# Altium schematic sheet POWER.SchDoc: Fogget
size A4; Revision: 0.1; SheetNumber: 3; SheetTotal: 7
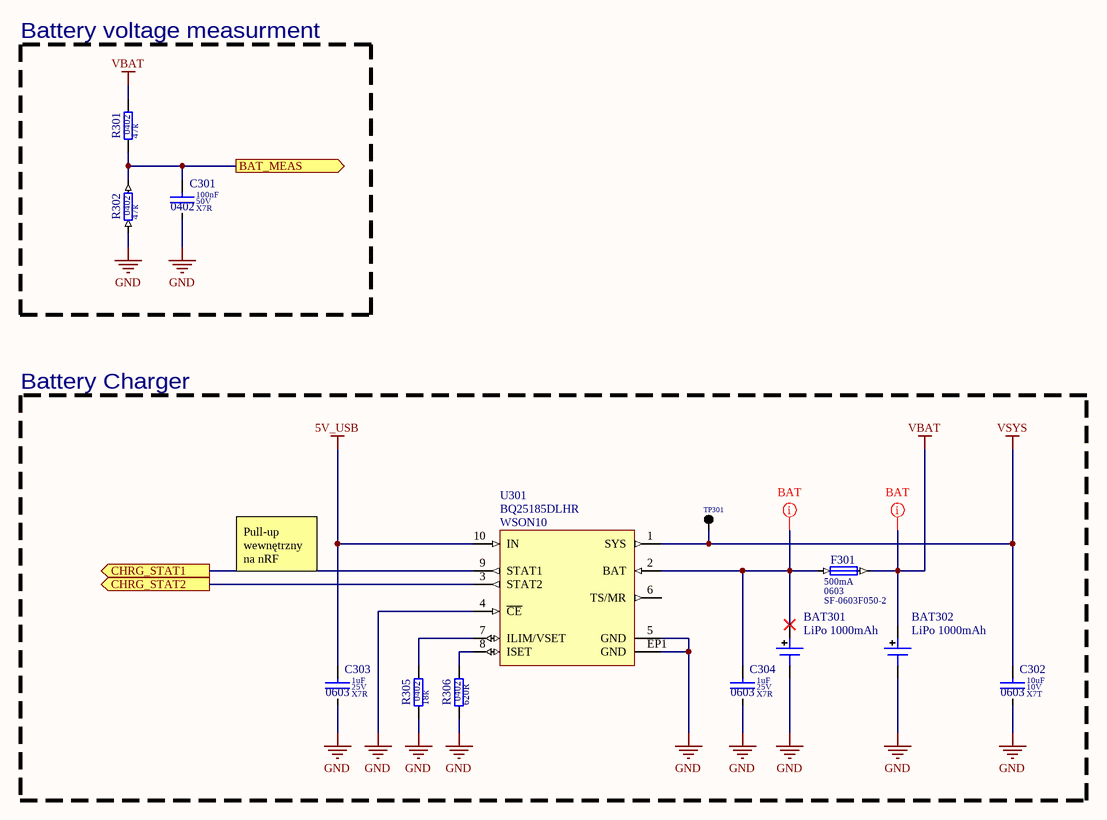
[diagram p0: POWER.SchDoc]

## Parts
BAT301  value LiPo 1000mAh  [BAT_SOLDERING_PADS]  (hidden comment: MECH_BT)
BAT302  value LiPo 1000mAh  [BAT_SOLDERING_PADS]  (hidden comment: MECH_BT)
C301  value 100nF  Dielectric: X7R  Voltage: 50V  SCH_Footprint: 0402  [C_0402_1005]  (hidden comment: Ceramic X7R)
C302  value 10uF  Dielectric: X7T  Voltage: 10V  SCH_Footprint: 0603  [C_0603_1608]  (hidden comment: Ceramic X7T Low ESR and ESL)
C303  value 1uF  Dielectric: X7R  Voltage: 25V  SCH_Footprint: 0603  [C_0603_1608]  (hidden comment: Ceramic X7R)
C304  value 1uF  Dielectric: X7R  Voltage: 25V  SCH_Footprint: 0603  [C_0603_1608]  (hidden comment: Ceramic X7R)
F301  value SF-0603F050-2  SCH_Footprint: 0603  Current: 500mA  [F_0603_1608]  (hidden comment: Fuse)
R301  value 47k  SCH_Footprint: 0402  [R_0402_1005]  (hidden comment: Resistor)
R302  value 47k  SCH_Footprint: 0402  [R_0402_1005]  (hidden comment: Resistor)
R305  value 18k  SCH_Footprint: 0402  [R_0402_1005]  (hidden comment: Resistor)
R306  value 620R  SCH_Footprint: 0402  [R_0402_1005]  (hidden comment: Resistor)
TP301  SMD pad  [TP_PAD]  (value not drawn)  (no BOM)
U301  value BQ25185DLHR  SCH_Footprint: WSON10  [WSON10_2.2x2]  (hidden comment: 1-cell, 1-A stand-alone linear battery charger with power path and solar input support)

## Blocks framed on the sheet
Battery voltage measurment: C301 R301 R302
Battery Charger: BAT301 BAT302 C302-C304 F301 R305 R306 TP301 U301

## Ports
BAT_MEAS (out, see Main[2B], nRF52833[3B]), CHRG_STAT1 (out, see Main[2B], nRF52833[3A]), CHRG_STAT2 (out, see Main[2B], nRF52833[3A])

## Nets
5V_USB: C303.1 U301.10(IN)
GND: BAT301.2 BAT302.2 C301.2 C302.2 C303.2 C304.2 R302.1 R305.1 R306.1 U301.4(~{CE}) U301.5(GND) U301.EP1(GND)
VBAT: BAT302.1 F301.2 R301.2
VSYS: C302.1 TP301.1(TP) U301.1(SYS)
BAT_MEAS: C301.1 R301.1 R302.2 ; port BAT_MEAS
CHRG_STAT1: U301.9(STAT1) ; port CHRG_STAT1
CHRG_STAT2: U301.3(STAT2) ; port CHRG_STAT2
NetBAT301_1: BAT301.1 C304.1 F301.1 U301.2(BAT)
NetR305_2: R305.2 U301.7(ILIM/VSET)
NetR306_2: R306.2 U301.8(ISET)

Not connected (* = marked no-connect by the designer): U301 6(TS/MR)

## Layout directives
net class BAT: NetBAT301_1, VBAT

## Notes on the sheet
- Pull-up wewnętrzny na nRF
- Title:
- Sheet:
- of
- Author:
- Model:
- Document Number:
- Checked by:
- Iss-Rev:
- Approved by:
- Date:
- File name:

## Library data of the parts
BAT301 BAT302 = MECH_BT: Battery
C301 = C_100nF_50V_X7R_0402_10: Capacitor; Manufacturer: Murata; Manufacturer Part Number: GRM155R71H104KE14D; Tolerance (%): 10; Part Number: C_100nF_50V_X7R_0402_10; HelpURL: http://docs-europe.electrocomponents.com/webdocs/145f/0900766b8145f9d2.pdf; Supplier 1: TME; Supplier Part Number 1: GRM155R71H104KE14D; Supplier 2: RS Components; Supplier Part Number 2: 8847087; Supplier 3: Farnell; Supplier Part Number 3: 2611912; Supplier 4: Mouser; Supplier Part Number 4: 81-GRM155R71H104KE4D; Supplier 5: Digi-Key; Supplier Part Number 5: 490-10700-1-ND; Supplier 6: LCSC
C302 = C_10uF_10V_X7T_0603_20: Capacitor; Manufacturer: Murata; Manufacturer Part Number: GRM188D71A106MA73D; Tolerance (%): 20; Part Number: C_10uF_10V_X7T_0603_20; HelpURL: https://pl.mouser.com/datasheet/2/281/murata_03052018_GRM_Series_1-1310166.pdf; Supplier 1: TME; Supplier 2: RS Components; Supplier Part Number 2: 8151349; Supplier 3: Farnell; Supplier Part Number 3: 2611920; Supplier 4: Mouser; Supplier Part Number 4: 81-GRM188D71A106MA3D; Supplier 5: Digi-Key; Supplier Part Number 5: 490-7200-1-ND; Supplier 6: LCSC; Supplier Part Number 6: C162270
C303 C304 = C_1uF_25V_X7R_0603_10_2: Capacitor; Manufacturer: Murata; Manufacturer Part Number: GCJ188R71E105KA01D; Tolerance (%): 10; Part Number: C_1uF_25V_X7R_0603_10_2; HelpURL: https://octopart.com/datasheet/gcj188r71e105ka01d-murata-49198830; Supplier 1: TME; Supplier Part Number 1: GCJ188R71E105KA01D; Supplier 2: RS Components; Supplier Part Number 2: 2477733; Supplier 3: Farnell; Supplier Part Number 3: 2781410; Supplier 4: Mouser; Supplier Part Number 4: 81-GCJ188R71E105KA1D; Supplier 5: Digi-Key; Supplier Part Number 5: 490-14409-1-ND; Supplier 6: LCSC
F301 = F_500mA_50V_0603: Manufacturer: Bourns; Voltage: 50V; Part Number: F_500mA_50V_0603; HelpURL: https://datasheet.octopart.com/SF-0603F050-2-Bourns-datasheet-16972401.pdf; Manufacturer Part Number: SF-0603F050-2; Supplier 1: TME; Supplier 2: RS Components; Supplier Part Number 2: 6924965P; Supplier 3: Farnell; Supplier Part Number 3: 1652130; Supplier 4: Mouser; Supplier 5: Digi-Key; Supplier Part Number 5: SF-0603F050-2CT-ND; Supplier 6: LCSC
R301 R302 = R_47k_0402_1: Manufacturer: Yageo; Manufacturer Part Number: RC0402FR-0747KL; Voltage: 50V; Power: 63mW; Tolerance: 1%; Part Number: R_47k_0402_1; HelpURL: https://datasheet.octopart.com/RC0402FR-0747KL-Yageo-datasheet-10408619.pdf; Supplier 1: TME; Supplier Part Number 1: RC0402FR-0747KL; Supplier 2: RS Components; Supplier 3: Farnell; Supplier Part Number 3: 2421898; Supplier 4: Mouser; Supplier Part Number 4: 603-RC0402FR-0747KL; Supplier 5: Digi-Key; Supplier Part Number 5: 311-47.0KLRCT-ND; Supplier 6: LCSC
R305 = R_18k_0402_1: Manufacturer: TE Connectivity; Manufacturer Part Number: CRG0402F18K; Voltage: 50V; Power: 63mW; Tolerance: 1%; Part Number: R_18k_0402_1; HelpURL: http://www.mouser.com/ds/2/418/NG_CD_1676480_BA-657809.pdf; Supplier 1: TME; Supplier 2: RS Components; Supplier 3: Farnell; Supplier Part Number 3: 2331472RL; Supplier 4: Mouser; Supplier Part Number 4: 279-CRG0402F18K; Supplier 5: Digi-Key; Supplier Part Number 5: CRG0402F18K-ND; Supplier 6: LCSC
R306 = R_620R_0402_1: Manufacturer: Panasonic; Manufacturer Part Number: ERJ-S02F6200X; Voltage: 50V; Power: 100mW; Tolerance: 1%; Part Number: R_620R_0402_1; HelpURL: https://industrial.panasonic.com/cdbs/www-data/pdf/RDP0000/AOA0000C334.pdf; Supplier 1: TME; Supplier 2: RS Components; Supplier 3: Farnell; Supplier Part Number 3: 3310109; Supplier 4: Mouser; Supplier Part Number 4: 667-ERJ-S02F6200X; Supplier 5: Digi-Key; Supplier Part Number 5: ERJ-S02F6200X-ND; Supplier 6: LCSC; Supplier Part Number 6: C2127168
TP301 = TP_PAD: Testpoint; Value: -; SCH_Footprint: SMD; Part Number: TP_PAD; HelpURL: -; Manufacturer: -; Manufacturer Part Number: -; Supplier 1: TME; Supplier 2: RS Components; Supplier 3: Farnell; Supplier 4: Mouser; Supplier 5: Digi-Key; Supplier 6: LCSC; Supplier 7: -; Supplier Part Number 7: -
U301 = U_BQ25185DLHR: Manufacturer: Texas Instruments; Part Number: U_BQ25185DLHR; HelpURL: https://www.ti.com/lit/ds/symlink/bq25185.pdf?ts=1724998842149&ref_url=https%253A%252F%252Fwww.ti.com%252Fproduct%252FBQ25185; Manufacturer Part Number: BQ25185DLHR; Supplier 1: TME; Supplier 2: RS Components; Supplier 3: Farnell; Supplier 4: Mouser; Supplier Part Number 4: 595-BQ25185DLHR; Supplier 5: Digi-Key; Supplier Part Number 5: 296-BQ25185DLHRCT-ND; Supplier 6: LCSC; Supplier 7: Texas Instruments; Supplier Part Number 7: BQ25185DLHR